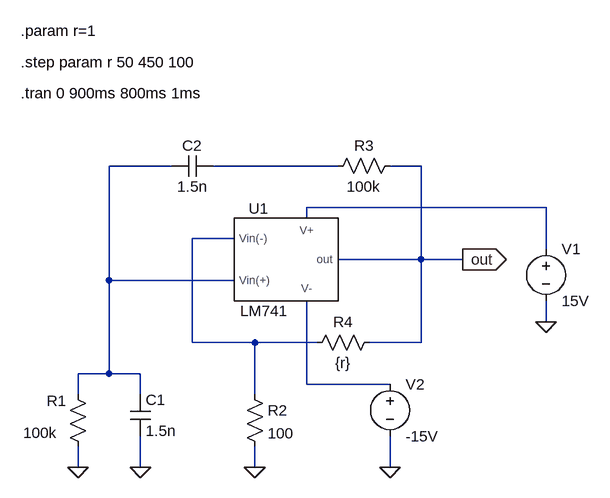
[diagram p0: schematic exercise5.asc]
exercise5.asc, the LTspice schematic file:
Version 4.1
SHEET 1 1344 680
WIRE 240 -224 144 -224
WIRE 496 -224 304 -224
WIRE 624 -224 576 -224
WIRE 816 -160 448 -160
WIRE 448 -144 448 -160
WIRE 336 -112 272 -112
WIRE 816 -96 816 -160
WIRE 624 -80 624 -224
WIRE 624 -80 496 -80
WIRE 688 -80 624 -80
WIRE 144 -48 144 -224
WIRE 336 -48 144 -48
WIRE 816 16 816 -16
WIRE 272 48 272 -112
WIRE 368 48 272 48
WIRE 464 48 368 48
WIRE 624 48 624 -80
WIRE 624 48 544 48
WIRE 144 96 144 -48
WIRE 144 96 96 96
WIRE 192 96 144 96
WIRE 448 112 448 -16
WIRE 576 112 448 112
WIRE 96 128 96 96
WIRE 192 128 192 96
WIRE 368 128 368 48
WIRE 96 240 96 208
WIRE 192 240 192 192
WIRE 368 240 368 208
WIRE 576 240 576 192
FLAG 368 240 0
FLAG 192 240 0
FLAG 96 240 0
FLAG 576 240 0
FLAG 816 16 0
FLAG 688 -80 out
IOPIN 688 -80 Out
SYMBOL res 80 112 R0
WINDOW 0 -32 26 Left 2
WINDOW 3 -68 75 Left 2
SYMATTR InstName R1
SYMATTR Value 100k
SYMBOL res 352 112 R0
SYMATTR InstName R2
SYMATTR Value 100
SYMBOL res 592 -240 R90
WINDOW 0 0 56 VBottom 2
WINDOW 3 32 56 VTop 2
SYMATTR InstName R3
SYMATTR Value 100k
SYMBOL cap 176 128 R0
SYMATTR InstName C1
SYMATTR Value 1.5n
SYMBOL res 560 32 R90
WINDOW 0 0 56 VBottom 2
WINDOW 3 32 56 VTop 2
SYMATTR InstName R4
SYMATTR Value {r}
SYMBOL cap 304 -240 R90
WINDOW 0 0 32 VBottom 2
WINDOW 3 32 32 VTop 2
SYMATTR InstName C2
SYMATTR Value 1.5n
SYMBOL voltage 816 -112 R0
SYMATTR InstName V1
SYMATTR Value 15V
SYMBOL voltage 576 96 R0
SYMATTR InstName V2
SYMATTR Value -15V
SYMBOL LM741 384 -96 R0
SYMATTR InstName U1
TEXT 8 -336 Left 2 !.tran 0 900ms 800ms 1ms
TEXT 8 -432 Left 2 !.param r=1
TEXT 8 -384 Left 2 !.step param r 50 450 100

The netlist it stands for:
* exercise5.asc
R1 N001 0 100k
R2 N004 0 100
R3 out N002 100k
C1 N001 0 1.5n
R4 out N004 {r}
C2 N002 N001 1.5n
V1 N003 0 15V
V2 N005 0 -15V
X§U1 N001 N004 N003 N005 out LM741  ; pins Vin(+) Vin(-) V+ V- out
.tran 0 900ms 800ms 1ms
.param r=1
.step param r 50 450 100
.lib C:\users\kou\Documents\Electronics\Electronics_2\LM741\lm741.lib
.backanno
.end